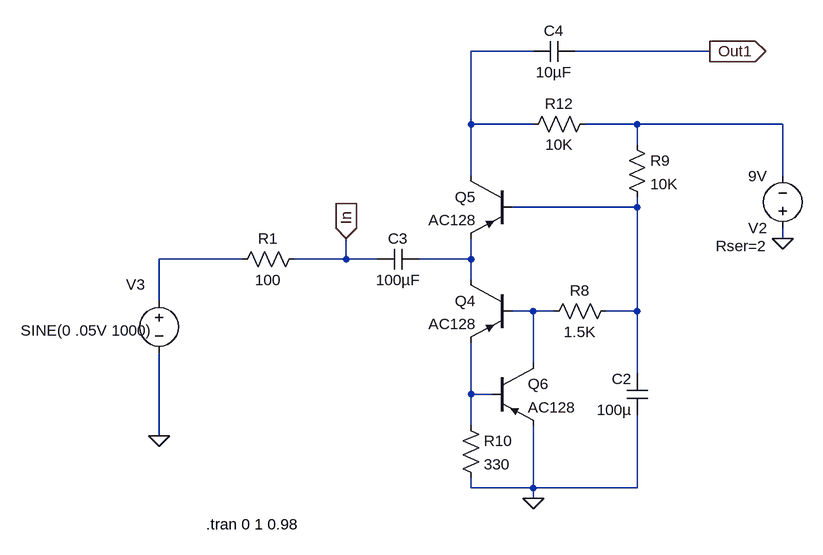
[diagram p0: schematic mixer.asc]
mixer.asc, the LTspice schematic file:
Version 4
SHEET 1 1156 680
WIRE 608 -720 512 -720
WIRE 880 -720 672 -720
WIRE 512 -608 512 -720
WIRE 608 -608 512 -608
WIRE 768 -608 688 -608
WIRE 992 -608 768 -608
WIRE 768 -576 768 -608
WIRE 512 -528 512 -608
WIRE 992 -528 992 -608
WIRE 768 -480 768 -496
WIRE 768 -480 576 -480
WIRE 992 -432 992 -448
WIRE 160 -400 32 -400
WIRE 320 -400 320 -432
WIRE 320 -400 240 -400
WIRE 368 -400 320 -400
WIRE 512 -400 512 -432
WIRE 512 -400 432 -400
WIRE 512 -368 512 -400
WIRE 32 -336 32 -400
WIRE 608 -320 576 -320
WIRE 640 -320 608 -320
WIRE 768 -320 768 -480
WIRE 768 -320 720 -320
WIRE 608 -240 608 -320
WIRE 768 -224 768 -320
WIRE 512 -192 512 -272
WIRE 544 -192 512 -192
WIRE 512 -144 512 -192
WIRE 32 -128 32 -256
WIRE 512 -48 512 -64
WIRE 608 -48 608 -144
WIRE 608 -48 512 -48
WIRE 768 -48 768 -160
WIRE 768 -48 608 -48
WIRE 608 -32 608 -48
FLAG 992 -432 0
FLAG 608 -32 0
FLAG 880 -720 Out1
IOPIN 880 -720 Out
FLAG 32 -128 0
FLAG 320 -432 In
IOPIN 320 -432 In
SYMBOL voltage 992 -432 R180
WINDOW 123 0 0 Left 2
WINDOW 39 24 -12 Left 2
SYMATTR SpiceLine Rser=2
SYMATTR InstName V2
SYMATTR Value 9V
SYMBOL pnp 576 -528 M0
SYMATTR InstName Q5
SYMATTR Value AC128
SYMBOL voltage 32 -352 R0
WINDOW 39 -112 95 Left 2
WINDOW 3 -213 62 Left 2
WINDOW 0 -51 -9 Left 2
SYMATTR Value SINE(0 .05V 1000)
SYMATTR InstName V3
SYMATTR Value2 AC 1
SYMBOL cap 784 -224 M0
SYMATTR InstName C2
SYMATTR Value 100µ
SYMBOL pnp 576 -368 M0
SYMATTR InstName Q4
SYMATTR Value AC128
SYMBOL pnp 544 -240 R0
SYMATTR InstName Q6
SYMATTR Value AC128
SYMBOL res 736 -336 R90
WINDOW 0 0 56 VBottom 2
WINDOW 3 32 56 VTop 2
SYMATTR InstName R8
SYMATTR Value 1.5K
SYMBOL res 752 -592 R0
SYMATTR InstName R9
SYMATTR Value 10K
SYMBOL res 496 -160 R0
SYMATTR InstName R10
SYMATTR Value 330
SYMBOL cap 432 -416 R90
WINDOW 0 0 32 VBottom 2
WINDOW 3 32 32 VTop 2
SYMATTR InstName C3
SYMATTR Value 100µF
SYMBOL res 704 -624 R90
WINDOW 0 0 56 VBottom 2
WINDOW 3 32 56 VTop 2
SYMATTR InstName R12
SYMATTR Value 10K
SYMBOL cap 672 -736 R90
WINDOW 0 0 32 VBottom 2
WINDOW 3 32 32 VTop 2
SYMATTR InstName C4
SYMATTR Value 10µF
SYMBOL res 256 -416 R90
WINDOW 0 0 56 VBottom 2
WINDOW 3 32 56 VTop 2
SYMATTR InstName R1
SYMATTR Value 100
TEXT 104 8 Left 2 !.tran 0 1 0.98

The netlist it stands for:
* mixer.asc
V2 0 N002 9V Rser=2
Q5 N001 N003 N005 0 AC128
V3 N004 0 SINE(0 .05V 1000) AC 1
C2 N003 0 100µ
Q4 N005 N006 N007 0 AC128
Q6 N006 N007 0 0 AC128
R8 N003 N006 1.5K
R9 N002 N003 10K
R10 N007 0 330
C3 N005 In 100µF
R12 N002 N001 10K
C4 Out1 N001 10µF
R1 In N004 100
.model NPN NPN
.model PNP PNP
.lib standard.bjt
.tran 0 1 0.98
.backanno
.end